# Altium project B100.PrjPcb (part 7 of 7)
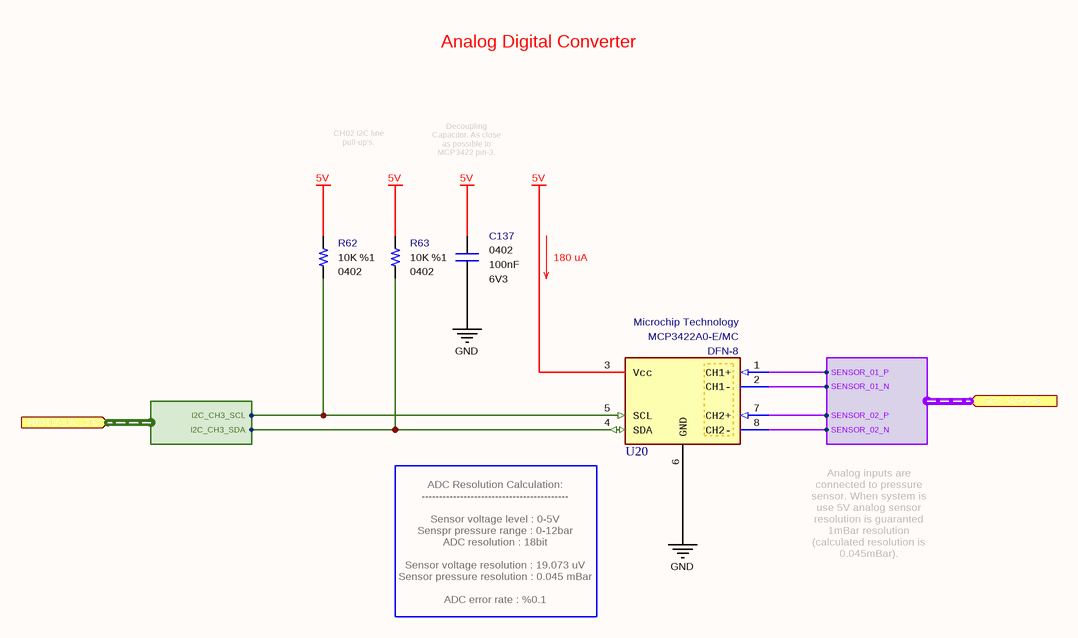
[diagram p63: Analog Digital Converter.SchDoc]

## Nets that join several sheets
3V3: Main Power Switch (C12.1 U2.1), 3V3 LDO Regulator (C14.1 C15.2 C16.1 U3.5), Module Output Sockets (8 pins), Real Time Clock (C131.2 U17.6)
3V8: 3V8 Buck Boost Converter (6 pins), GSM Power (C5.1 U1.1), 3V3 LDO Regulator (C13.1 U3.1 U3.3), Module Output Sockets (8 pins)
5V: 5V Buck Boost Converter (6 pins), Module Output Sockets (C104.2 C112.2 J2.34 J3.3), Analog Digital Converter (C137.2 R62.2 R63.2 U20.3)
GND: 3V8 Buck Boost Converter (10 pins), 5V Buck Boost Converter (12 pins), GSM Power (11 pins), Main Power Switch (5 pins), 3V3 LDO Regulator (5 pins), GE910QUAD Modem (51 pins), GSM Signal Control (6 pins), Bidirectional Voltage Translator (38 pins), GSM LED Indicators (12 pins), Master MicroController Core (13 pins), Module Output Sockets (36 pins), Filter Capacitors - Port K (8 pins), Filter Capacitors - Master ICSP (5 pins), Filter Capacitors - Port C (8 pins), Filter Capacitors - Port L (8 pins), Filter Capacitors - FOTA ICSP (5 pins), Filter Capacitors - External SIM (C172.1 C173.1 C174.1 C175.1), Filter Capacitors - Signal IoT (6 pins), Filter Capacitors - Port A (8 pins), Filter Capacitors - FOTA Digital ICSP (C190.1 C191.1 C192.1 C193.1), Filter Capacitors - IoT UART (8 pins), Filter Capacitors - Port F (8 pins), Filter Capacitors - Serial Communication (6 pins), Filter Capacitors - ADC Sensor (C216.1 C217.1 C218.1 C219.1), Filter Capacitors - I2C (C220.1 C221.1), FOTA MicroController Power Switch (10 pins), SD Card (7 pins), ICSP Burn Buffer (5 pins), FOTA MicroController (23 pins), Buzzer (6 pins), Master MicroController LED (13 pins), I2C Multiplexer (5 pins), Real Time Clock (6 pins), Serial ID EEPROM (C135.1 U18.2), EEPROM (6 pins), Analog Digital Converter (C137.1 U20.6)
VAUX: GE910QUAD Modem (C17.2 U4.R11), Bidirectional Voltage Translator (7 pins)
VCC: 3V8 Buck Boost Converter (5 pins), 5V Buck Boost Converter (C228.2 C229.1 C230.1 U22.10), Module Output Sockets (8 pins)
VFOTA: Module Output Sockets (C107.2 J2.3), FOTA MicroController Power Switch (R27.1 U10.6), ICSP Burn Buffer (C80.2 U13.19), FOTA MicroController (9 pins)
VIOT1: GSM Power (C1.1 C2.2 C3.2 FB1.2), GE910QUAD Modem (U4.M01 U4.M02)
VIOT2: GSM Power (C7.1 C8.2 C9.2 FB2.2), GE910QUAD Modem (U4.N01 U4.N02 U4.P01 U4.P02)
VMCU: Main Power Switch (C10.1 R3.1 U2.6), Bidirectional Voltage Translator (14 pins), GSM LED Indicators (C54.1 Q3.2 R17.2), Master MicroController Core (10 pins), Module Output Sockets (8 pins), FOTA MicroController Power Switch (C60.2 C61.1 U9.1 U10.1), SD Card (8 pins), ICSP Burn Buffer (C81.2 U13.2), Buzzer (C83.2 U14.1 U14.2 U14.12), Master MicroController LED (C97.1 D3.4), I2C Multiplexer (5 pins), Real Time Clock (6 pins), Serial ID EEPROM (C135.2 R58.2 R59.2 U18.5), EEPROM (C136.2 R60.2 R61.2 U19.8)
FOTA_DIGITAL_ICSP.FOTA_DIGITAL_MISO: Module Output Sockets (J3.46), Filter Capacitors - FOTA Digital ICSP (C190.2), ICSP Burn Buffer (U13.15), FOTA MicroController (U11.30)
FOTA_DIGITAL_ICSP.FOTA_DIGITAL_MOSI: Module Output Sockets (J3.45), Filter Capacitors - FOTA Digital ICSP (C191.2), ICSP Burn Buffer (U13.14), FOTA MicroController (U11.31)
FOTA_DIGITAL_ICSP.FOTA_DIGITAL_RESET: Module Output Sockets (J3.43), Filter Capacitors - FOTA Digital ICSP (C193.2), ICSP Burn Buffer (U13.12), FOTA MicroController (U11.1)
FOTA_DIGITAL_ICSP.FOTA_DIGITAL_SCK: Module Output Sockets (J3.44), Filter Capacitors - FOTA Digital ICSP (C192.2), ICSP Burn Buffer (U13.13), FOTA MicroController (U11.32)
FOTA_ICSP.FOTA_MISO: Module Output Sockets (J3.14), Filter Capacitors - FOTA ICSP (C168.2), SD Card (U12.5), FOTA MicroController (U11.16)
FOTA_ICSP.FOTA_MOSI: Module Output Sockets (J3.13), Filter Capacitors - FOTA ICSP (C167.2), SD Card (U12.2), FOTA MicroController (U11.15)
FOTA_ICSP.FOTA_RESET: Module Output Sockets (J3.16), Filter Capacitors - FOTA ICSP (C170.2), FOTA MicroController (C76.2 R36.1 U11.29)
FOTA_ICSP.FOTA_SCK: Module Output Sockets (J3.15), Filter Capacitors - FOTA ICSP (C169.2), SD Card (U12.11), FOTA MicroController (U11.17)
FOTA_ICSP.FOTA_SS: Module Output Sockets (J3.17), Filter Capacitors - FOTA ICSP (C171.2), SD Card (U12.14), FOTA MicroController (U11.14)
GSM_3V3_UART.GSM_3V3_CTS: Bidirectional Voltage Translator (C45.2 U8.7), Master MicroController Port J (U15.66), Module Output Sockets (J3.53), Filter Capacitors - IoT UART (C198.2)
GSM_3V3_UART.GSM_3V3_DCD: Bidirectional Voltage Translator (C37.2 U7.6), Master MicroController Port J (U15.68), Module Output Sockets (J3.52), Filter Capacitors - IoT UART (C199.2)
GSM_3V3_UART.GSM_3V3_DSR: Bidirectional Voltage Translator (C36.2 U7.7), Master MicroController Port J (U15.69), Module Output Sockets (J3.51), Filter Capacitors - IoT UART (C200.2)
GSM_3V3_UART.GSM_3V3_DTR: Bidirectional Voltage Translator (C48.2 R15.1 U8.4), Master MicroController Port J (U15.65), Module Output Sockets (J3.55), Filter Capacitors - IoT UART (C196.2)
GSM_3V3_UART.GSM_3V3_RING: Bidirectional Voltage Translator (C31.2 U6.6), Master MicroController Port J (U15.79), Module Output Sockets (J3.50), Filter Capacitors - IoT UART (C201.2)
GSM_3V3_UART.GSM_3V3_RTS: Bidirectional Voltage Translator (C38.2 U7.4), Master MicroController Port J (U15.67), Module Output Sockets (J3.54), Filter Capacitors - IoT UART (C197.2)
GSM_3V3_UART.GSM_3V3_RX: Bidirectional Voltage Translator (C47.2 U8.5), Master MicroController Serial Communication Port (U15.64), Module Output Sockets (J3.57), Filter Capacitors - IoT UART (C194.2)
GSM_3V3_UART.GSM_3V3_TX: Bidirectional Voltage Translator (C46.2 U8.6), Master MicroController Serial Communication Port (U15.63), Module Output Sockets (J3.56), Filter Capacitors - IoT UART (C195.2)
MASTER_I2C.MASTER_SCL: Master MicroController Serial Communication Port (U15.43), Module Output Sockets (J2.45), Filter Capacitors - I2C (C221.2), I2C Multiplexer (R52.1 U16.14)
MASTER_I2C.MASTER_SDA: Master MicroController Serial Communication Port (U15.44), Module Output Sockets (J2.46), Filter Capacitors - I2C (C220.2), I2C Multiplexer (R53.1 U16.15)
MASTER_ICSP.MASTER_MISO: Master MicroController Core (U15.22), Module Output Sockets (J2.16), Filter Capacitors - Master ICSP (C149.2), SD Card (U12.6), ICSP Burn Buffer (U13.6)
MASTER_ICSP.MASTER_MOSI: Master MicroController Core (U15.21), Module Output Sockets (J2.15), Filter Capacitors - Master ICSP (C148.2), SD Card (U12.3), ICSP Burn Buffer (U13.7)
MASTER_ICSP.MASTER_RESET: Master MicroController Core (C94.2 R45.1 U15.30), Module Output Sockets (J2.17), Filter Capacitors - Master ICSP (C150.2), ICSP Burn Buffer (U13.9)
MASTER_ICSP.MASTER_SCK: Master MicroController Core (U15.20), Module Output Sockets (J2.14), Filter Capacitors - Master ICSP (C147.2), SD Card (U12.10), ICSP Burn Buffer (U13.8)
MASTER_ICSP.MASTER_SS: Master MicroController Core (U15.19), Module Output Sockets (J2.13), Filter Capacitors - Master ICSP (C146.2), SD Card (U12.13)
NetC32_2: GE910QUAD Modem (U4.R14), Bidirectional Voltage Translator (C32.2 U6.11)
NetC39_2: GE910QUAD Modem (U4.P14), Bidirectional Voltage Translator (C39.2 U7.10)
NetC40_2: GE910QUAD Modem (U4.N14), Bidirectional Voltage Translator (C40.2 U7.11)
NetC41_2: GE910QUAD Modem (U4.L14), Bidirectional Voltage Translator (C41.2 U7.13)
NetC49_2: GE910QUAD Modem (U4.P15), Bidirectional Voltage Translator (C49.2 U8.10)
NetC50_2: GE910QUAD Modem (U4.M15), Bidirectional Voltage Translator (C50.2 U8.11)
NetC51_2: GE910QUAD Modem (U4.N15), Bidirectional Voltage Translator (C51.2 U8.12)
NetC52_2: GE910QUAD Modem (U4.M14), Bidirectional Voltage Translator (C52.2 U8.13)
NetC216_2: Module Output Sockets (J2.42), Filter Capacitors - ADC Sensor (C216.2), Analog Digital Converter (U20.8)
NetC217_2: Module Output Sockets (J2.41), Filter Capacitors - ADC Sensor (C217.2), Analog Digital Converter (U20.7)
NetC218_2: Module Output Sockets (J2.44), Filter Capacitors - ADC Sensor (C218.2), Analog Digital Converter (U20.2)
NetC219_2: Module Output Sockets (J2.43), Filter Capacitors - ADC Sensor (C219.2), Analog Digital Converter (U20.1)
NetQ1_3: GE910QUAD Modem (U4.R12), GSM Signal Control (Q1.3)
NetQ2_3: GE910QUAD Modem (U4.R13), GSM Signal Control (Q2.3)
NetR23_2: GE910QUAD Modem (U4.C08), GSM LED Indicators (R23.2)
NetR24_2: GE910QUAD Modem (U4.B14), GSM LED Indicators (R24.2)
NetR54_1: I2C Multiplexer (U16.5), Real Time Clock (R54.1 U17.3)
NetR55_1: I2C Multiplexer (U16.4), Real Time Clock (R55.1 U17.4)
NetR58_1: I2C Multiplexer (U16.7), Serial ID EEPROM (R58.1 U18.1)
NetR59_1: I2C Multiplexer (U16.6), Serial ID EEPROM (R59.1 U18.3)
NetR60_1: I2C Multiplexer (U16.10), EEPROM (R60.1 U19.6)
NetR61_1: I2C Multiplexer (U16.9), EEPROM (R61.1 U19.5)
NetR62_1: I2C Multiplexer (U16.12), Analog Digital Converter (R62.1 U20.5)
NetR63_1: I2C Multiplexer (U16.11), Analog Digital Converter (R63.1 U20.4)
PORT_A.PA0: Master MicroController Port A (U15.78), Module Output Sockets (J3.34), Filter Capacitors - Port A (C182.2)
PORT_A.PA1: Master MicroController Port A (U15.77), Module Output Sockets (J3.35), Filter Capacitors - Port A (C183.2)
PORT_A.PA2: Master MicroController Port A (U15.76), Module Output Sockets (J3.36), Filter Capacitors - Port A (C184.2)
PORT_A.PA3: Master MicroController Port A (U15.75), Module Output Sockets (J3.37), Filter Capacitors - Port A (C185.2)
PORT_A.PA4: Master MicroController Port A (U15.74), Module Output Sockets (J3.38), Filter Capacitors - Port A (C186.2)
PORT_A.PA5: Master MicroController Port A (U15.73), Module Output Sockets (J3.39), Filter Capacitors - Port A (C187.2)
PORT_A.PA6: Master MicroController Port A (U15.72), Module Output Sockets (J3.40), Filter Capacitors - Port A (C188.2)
PORT_A.PA7: Master MicroController Port A (U15.71), Module Output Sockets (J3.41), Filter Capacitors - Port A (C189.2)
PORT_C.PC0: Master MicroController Port C (U15.53), Module Output Sockets (J2.18), Filter Capacitors - Port C (C151.2)
PORT_C.PC1: Master MicroController Port C (U15.54), Module Output Sockets (J2.19), Filter Capacitors - Port C (C152.2)
PORT_C.PC2: Master MicroController Port C (U15.55), Module Output Sockets (J2.20), Filter Capacitors - Port C (C153.2)
PORT_C.PC3: Master MicroController Port C (U15.56), Module Output Sockets (J2.21), Filter Capacitors - Port C (C154.2)
PORT_C.PC4: Master MicroController Port C (U15.57), Module Output Sockets (J2.22), Filter Capacitors - Port C (C155.2)
PORT_C.PC5: Master MicroController Port C (U15.58), Module Output Sockets (J2.23), Filter Capacitors - Port C (C156.2)
PORT_C.PC6: Master MicroController Port C (U15.59), Module Output Sockets (J2.24), Filter Capacitors - Port C (C157.2)
PORT_C.PC7: Master MicroController Port C (U15.60), Module Output Sockets (J2.25), Filter Capacitors - Port C (C158.2)
PORT_F.PF0: Master MicroController Port F (U15.97), Module Output Sockets (J2.57), Filter Capacitors - Port F (C202.2)
PORT_F.PF1: Master MicroController Port F (U15.96), Module Output Sockets (J2.56), Filter Capacitors - Port F (C203.2)
PORT_F.PF2: Master MicroController Port F (U15.95), Module Output Sockets (J2.55), Filter Capacitors - Port F (C204.2)
PORT_F.PF3: Master MicroController Port F (U15.94), Module Output Sockets (J2.54), Filter Capacitors - Port F (C205.2)
PORT_F.PF4: Master MicroController Port F (U15.93), Module Output Sockets (J2.53), Filter Capacitors - Port F (C206.2)
PORT_F.PF5: Master MicroController Port F (U15.92), Module Output Sockets (J2.52), Filter Capacitors - Port F (C207.2)
PORT_F.PF6: Master MicroController Port F (U15.91), Module Output Sockets (J2.51), Filter Capacitors - Port F (C208.2)
PORT_F.PF7: Master MicroController Port F (U15.90), Module Output Sockets (J2.50), Filter Capacitors - Port F (C209.2)
PORT_K.PK0: Master MicroController Port K (U15.89), Module Output Sockets (J2.5), Filter Capacitors - Port K (C138.2)
PORT_K.PK1: Master MicroController Port K (U15.88), Module Output Sockets (J2.6), Filter Capacitors - Port K (C139.2)
PORT_K.PK2: Master MicroController Port K (U15.87), Module Output Sockets (J2.7), Filter Capacitors - Port K (C140.2)
PORT_K.PK3: Master MicroController Port K (U15.86), Module Output Sockets (J2.8), Filter Capacitors - Port K (C141.2)
PORT_K.PK4: Master MicroController Port K (U15.85), Module Output Sockets (J2.9), Filter Capacitors - Port K (C142.2)
PORT_K.PK5: Master MicroController Port K (U15.84), Module Output Sockets (J2.10), Filter Capacitors - Port K (C143.2)
PORT_K.PK6: Master MicroController Port K (U15.83), Module Output Sockets (J2.11), Filter Capacitors - Port K (C144.2)
PORT_K.PK7: Master MicroController Port K (U15.82), Module Output Sockets (J2.12), Filter Capacitors - Port K (C145.2)
PORT_L.PL0: Master MicroController Port L (U15.35), Module Output Sockets (J3.5), Filter Capacitors - Port L (C159.2)
PORT_L.PL1: Master MicroController Port L (U15.36), Module Output Sockets (J3.6), Filter Capacitors - Port L (C160.2)
PORT_L.PL2: Master MicroController Port L (U15.37), Module Output Sockets (J3.7), Filter Capacitors - Port L (C161.2)
PORT_L.PL3: Master MicroController Port L (U15.38), Module Output Sockets (J3.8), Filter Capacitors - Port L (C162.2)
PORT_L.PL4: Master MicroController Port L (U15.39), Module Output Sockets (J3.9), Filter Capacitors - Port L (C163.2)
PORT_L.PL5: Master MicroController Port L (U15.40), Module Output Sockets (J3.10), Filter Capacitors - Port L (C164.2)
PORT_L.PL6: Master MicroController Port L (U15.41), Module Output Sockets (J3.11), Filter Capacitors - Port L (C165.2)
PORT_L.PL7: Master MicroController Port L (U15.42), Module Output Sockets (J3.12), Filter Capacitors - Port L (C166.2)
SIGNAL_FOTA_BURN_EN: Module Output Sockets (C123.2 J3.47), ICSP Burn Buffer (C82.1 R43.2 U13.10), FOTA MicroController (U11.13)
SIGNAL_FOTA_POWER_DONE: Module Output Sockets (C125.2 J3.49), FOTA MicroController Power Switch (C62.2 R29.2 U9.4), FOTA MicroController (U11.12)
SIGNAL_FOTA_POWER_EN: Master MicroController Port E (U15.5), Module Output Sockets (C124.2 J3.48), FOTA MicroController Power Switch (R28.2 U9.3)
SIGNAL_IOT_3V3.SIGNAL_IOT_3V3_ONOFF: GSM Signal Control (R8.2), Master MicroController Port H (U15.17), Module Output Sockets (J3.25), Filter Capacitors - Signal IoT (C179.2)
SIGNAL_IOT_3V3.SIGNAL_IOT_3V3_PMON: Bidirectional Voltage Translator (C30.2 U6.7), GSM LED Indicators (R22.2), Master MicroController Port H (U15.27), Module Output Sockets (J3.27), Filter Capacitors - Signal IoT (C181.2)
SIGNAL_IOT_3V3.SIGNAL_IOT_3V3_SDOWN: GSM Signal Control (R9.2), Master MicroController Port H (U15.18), Module Output Sockets (J3.26), Filter Capacitors - Signal IoT (C180.2)
SIGNAL_IOT_3V3.SIGNAL_IOT_COM_EN: Bidirectional Voltage Translator (7 pins), Master MicroController Port H (U15.15), Module Output Sockets (J3.23), Filter Capacitors - Signal IoT (C177.2)
SIGNAL_IOT_3V3.SIGNAL_IOT_LED_EN: GSM LED Indicators (R18.2), Master MicroController Port H (U15.16), Module Output Sockets (J3.24), Filter Capacitors - Signal IoT (C178.2)
SIGNAL_IOT_3V3.SIGNAL_IOT_POWER_EN: GSM Power (C4.2 R2.2 U1.3), Master MicroController Port H (U15.14), Module Output Sockets (J3.22), Filter Capacitors - Signal IoT (C176.2)
SIGNAL_MASTER_MCU_LED1: Master MicroController Port D (U15.47), Master MicroController LED (C95.1 Q10.1 R47.2)
SIGNAL_MASTER_MCU_LED2: Master MicroController Port D (U15.48), Master MicroController LED (C98.1 Q11.1 R49.2)
SIGNAL_MASTER_MCU_LED3: Master MicroController Port D (U15.49), Master MicroController LED (C100.1 Q12.1 R51.2)
SIGNAL_MCU_POWER_EN: Main Power Switch (C11.2 R4.2 U2.3), Module Output Sockets (C122.2 J3.42)
SIGNAL_POWER_5V_EN: 5V Buck Boost Converter (C234.2 R69.2 U22.1), Master MicroController Port E (U15.9), Module Output Sockets (C120.2 J2.26)
SIGNAL_POWER_DONE: Master MicroController Port E (U15.8), Module Output Sockets (C121.2 J2.27)
SIGNAL_PWM_BUZZER: Master MicroController Port E (U15.6), Module Output Sockets (C114.2 J2.48), Buzzer (C85.2 R44.2 U14.3)
SIGNAL_RTC_INTERUPT: Master MicroController Port E (U15.7), Module Output Sockets (C113.2 J2.47), Real Time Clock (C133.1 R56.1 U17.2)
SIGNAL_SD_MUX_DIRECTION: Master MicroController Port E (U15.4), Module Output Sockets (C115.2 J2.49), SD Card (C79.2 R42.2 U12.1)
SIM_CLK: GE910QUAD Modem (C19.2 U4.A06 U5.6), Module Output Sockets (J3.18), Filter Capacitors - External SIM (C172.2)
SIM_IO: GE910QUAD Modem (C18.2 U4.A05 U5.3), Module Output Sockets (J3.20), Filter Capacitors - External SIM (C174.2)
SIM_RST: GE910QUAD Modem (C20.2 U4.A07 U5.7), Module Output Sockets (J3.19), Filter Capacitors - External SIM (C173.2)
SIM_VCC: GE910QUAD Modem (C21.2 C22.2 U4.A03 U5.8), Module Output Sockets (J3.21), Filter Capacitors - External SIM (C175.2)
UART0.RXD0: Master MicroController Serial Communication Port (U15.2), Module Output Sockets (J2.36), Filter Capacitors - Serial Communication (C210.2)
UART0.TXD0: Master MicroController Serial Communication Port (U15.3), Module Output Sockets (J2.35), Filter Capacitors - Serial Communication (C211.2)
UART1.RXD1: Master MicroController Serial Communication Port (U15.45), Module Output Sockets (J2.38), Filter Capacitors - Serial Communication (C212.2)
UART1.TXD1: Master MicroController Serial Communication Port (U15.46), Module Output Sockets (J2.37), Filter Capacitors - Serial Communication (C213.2)
UART2.RXD2: Master MicroController Serial Communication Port (U15.12), Module Output Sockets (J2.40), Filter Capacitors - Serial Communication (C214.2)
UART2.TXD2: Master MicroController Serial Communication Port (U15.13), Module Output Sockets (J2.39), Filter Capacitors - Serial Communication (C215.2)

## Assembly variants
Prototype: not fitted C23 C24 C96 C97 C99 C101 C182 C183 C184 C185 C186 C187 C188 C189 C190 C191 C192 C193 C194 C195 C196 C197 C198 C199 C200 C201 C202 C203 C204 C205 C206 C207 C208 C209 C210 C211 C212 C213 C214 C215 C216 C217 C218 C219 C220 C221 C222 C223 C224 C225 C226 C227 C228 C229 C230 C231 C232 C233 C234 C235 C236 C237 C238 C239 C240 C241 C242 C243 C244 C245 C246 C247 C248 C249 C250 C251 C252 C253 C254 C255 C256 C257 C258 C259 C260 C261 C262 C263 C264 C265 D3 L1 L2 Q10 Q11 Q12 R46 R48 R50
Bulk Production: not fitted C54 C55 C56 C57 C58 C59 C68 C69 C71 C73 C102 C103 C104 C105 C106 C107 C108 C109 C110 C111 C112 C113 C114 C115 C116 C117 C118 C119 C120 C121 C122 C123 C124 C125 C126 C127 C128 C129 C134 C138 C139 C140 C141 C142 C143 C144 C145 C146 C147 C148 C149 C150 C151 C152 C153 C154 C155 C156 C157 C158 C159 C160 C161 C162 C163 C164 C165 C166 C167 C168 C169 C170 C171 C172 C173 C174 C175 C176 C177 C178 C179 C180 C181 C182 C183 C184 C185 C186 C187 C188 C189 C190 C191 C192 C193 C194 C195 C196 C197 C198 C199 C200 C201 C202 C203 C204 C205 C206 C207 C208 C209 C210 C211 C212 C213 C214 C215 C216 C217 C218 C219 C220 C221 D1 D2 D4 Q3 Q4 Q5 Q6 Q7 Q8 Q9 Q13 R19 R20 R21 R22 R23 R24 R25 R26 R31 R32 R34 R57